# EAGLE design avr328 (EAGLE 9.6.2)
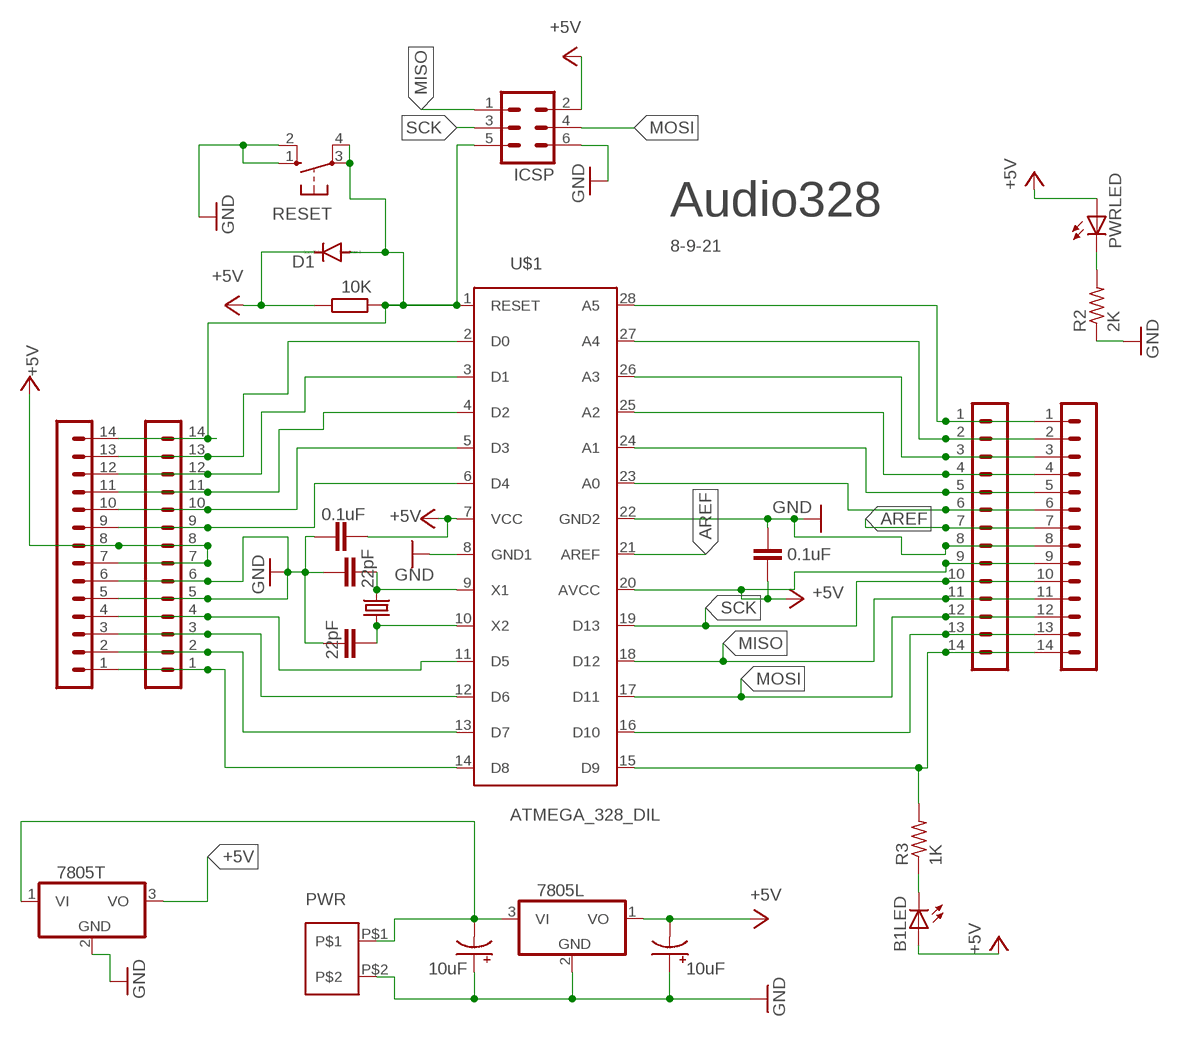
[diagram p0: schematic, sheet 1]

## Parts
-  14_PIN_CONN  [14_PIN_CONN]
.  14_PIN_CONN  [14_PIN_CONN]
.-  14_PIN_CONN  [14_PIN_CONN]
..  14_PIN_CONN  [14_PIN_CONN]
B1LED  LED3MM  [LED3MM]
C1  22pF  C-EU025-024X044  [C025-024X044]
C2  22pF  C-EU025-024X044  [C025-024X044]
C3  0.1uF  C-EU025-024X044  [C025-024X044]
C5  0.1uF  C-EU025-024X044  [C025-024X044]
C7  10uF  CPOL-USE2-5  [E2-5]
C8  10uF  CPOL-USE2-5  [E2-5]
D1  1N4148DO35-7  [DO35-7]
IC1  7805L  [TO92]
IC2  7805T  [TO220H]
ICSP  MA03-2  [MA03-2]
PWR  PWR  2_PIN_SCREW_CONN  [2_PIN_SCREW_CONN]
PWRLED  LED3MM  [LED3MM]
R1  10K  R-EU_0207/10  [0207/10]
R2  2K  R-US_0204/5  [0204/5]
R3  1K  R-US_0204/5  [0204/5]
RESET  10-XX  [B3F-10XX]
U$1  ATMEGA_328_DIL  [ATMEGA_328_DIL]
Y1  CRYSTALHC49UV  [HC49U-V]

## Nets
+5V [+5V]: -.9 .-.9 ..7 ..8 ...7 ...8 B1LED.A C3.2 C5.2 C7.- D1.C IC1.1(VO) IC2.3(VO) ICSP.2 PWRLED.A R1.1 U$1.7(VCC) U$1.20(AVCC)
AREF: -.7 .-.7 U$1.21(AREF)
GND: -.8 .-.8 ..5 ..6 ...5 ...6 C1.1 C2.1 C3.1 C5.1 C7.+ C8.+ IC1.2(GND) IC2.2(GND) ICSP.6 PWR.P$2 R2.1 RESET.1(S) RESET.2(S1) U$1.8(GND1) U$1.22(GND2)
MISO: -.11 .-.11 ICSP.1 U$1.18(D12)
MOSI: -.12 .-.12 ICSP.4 U$1.17(D11)
N$1: ..14 ...14 D1.A ICSP.5 R1.2 RESET.3(P) RESET.4(P1) U$1.1(RESET)
N$2: C1.2 U$1.9(X1) Y1.2
N$3: C2.2 U$1.10(X2) Y1.1
N$4: ..13 ...13 U$1.2(D0)
N$5: ..12 ...12 U$1.3(D1)
N$6: ..11 ...11 U$1.4(D2)
N$7: C8.- IC1.3(VI) IC2.1(VI) PWR.P$1
N$8: ..9 ...9 U$1.6(D4)
N$9: B1LED.K(C) R3.1
N$10: -.1 .-.1 U$1.28(A5)
N$11: -.2 .-.2 U$1.27(A4)
N$12: -.3 .-.3 U$1.26(A3)
N$13: -.4 .-.4 U$1.25(A2)
N$14: -.5 .-.5 U$1.24(A1)
N$15: -.6 .-.6 U$1.23(A0)
N$16: -.14 .-.14 R3.2 U$1.15(D9)
N$17: -.13 .-.13 U$1.16(D10)
N$19: PWRLED.K(C) R2.2
N$21: ..1 ...1 U$1.14(D8)
N$22: ..2 ...2 U$1.13(D7)
N$23: ..3 ...3 U$1.12(D6)
N$24: ..4 ...4 U$1.11(D5)
N$26: ..10 ...10 U$1.5(D3)
SCK: -.10 .-.10 ICSP.3 U$1.19(D13)

## Notes on the sheet
- Audio328
- 8-9-21

## Library data of the parts
- . .- .. = 14_PIN_CONN:14_PIN_CONN
B1LED PWRLED = adafruit:LED: LED OSRAM: - CHIPLED LG R971, LG N971, LY N971, LG Q971, LY Q971, LO R971, LY R971 LH N974, LH R974 LS Q976, LO Q976, LY Q976 LO Q996 - Hyper CHIPLED LW Q18S LB Q993, LB Q99A, LB R99A - SideLED LS A670, LO A670, LY A670, LG A670, LP A670 LB A673, LV A673, LT A673, LW A673 LH A674 LY A675 LS A676, LA A676, LO A676, LY A676, LW A676 LS A679, LY A679, LG A679 - Hyper Micro SIDELED® LS Y876, LA Y876, LO Y876, LY Y876 LT Y87S - SmartLED LW L88C, LW L88S LB L89C, LB L89S, LG L890 LS L89K, LO L89K, LY L89K LS L896, LA L896, LO L896, LY L896 - TOPLED LS T670, LO T670, LY T670, LG T670, LP T670 LSG T670, LSP T670, LSY T670, LOP T670, LYG T670 LG T671, LOG T671, LSG T671 LB T673, LV T673, LT T673, LW T673 LH T674 LS T676, LA T676, LO T676, LY T676, LB T676, LH T676, LSB T676, LW T676 LB T67C, LV T67C, LT T67C, LS T67K, LO T67K, LY T67K, LW E67C LS E67B, LA E67B, LO E67B, LY E67B, LB E67C, LV E67C, LT E67C LW T67C LS T679, LY T679, LG T679 LS T770, LO T770, LY T770, LG T770, LP T770 LB T773, LV T773, LT T773, LW T773 LH T774 LS E675, LA E675, LY E675, LS T675 LS T776, LA T776, LO T776, LY T776, LB T776 LHGB T686 LT T68C, LB T68C - Hyper Mini TOPLED® LB M676 - Mini TOPLED Santana® LG M470 LS M47K, LO M47K, LY M47K Source: http://www.osram.convergy.de/
C1-C3 C5 = resistor:C-EU: CAPACITOR, European symbol
C7 C8 = rcl:CPOL-US: POLARIZED CAPACITOR, American symbol; SPICEPREFIX: C
D1 = diode:1N4148: DIODE high speed (Philips)
IC1 IC2 = adafruit:78*: Positive VOLTAGE REGULATOR Added bigger pads to the TO-92 package
ICSP = con-lstb:MA03-2: PIN HEADER; OC_FARNELL: unknown; OC_NEWARK: unknown
PWR = 2 Pin screw Conn:2_PIN_SCREW_CONN
R1 = resistor:R-EU_: RESISTOR, European symbol
R2 R3 = adafruit:R-US_: RESISTOR, American symbol
RESET = switch-omron:10-XX: OMRON SWITCH; MPN: B3F-1000; OC_FARNELL: 176432; OC_NEWARK: 36M3542
U$1 = Atmega_328_DIL:ATMEGA_328_DIL
Y1 = SparkFun-FreqCtrl:CRYSTAL: Various standard crystals. Proven footprints. Spark Fun Electronics SKU : COM-00534

## Net classes
1 +5V: width 0.381 mm

## Board
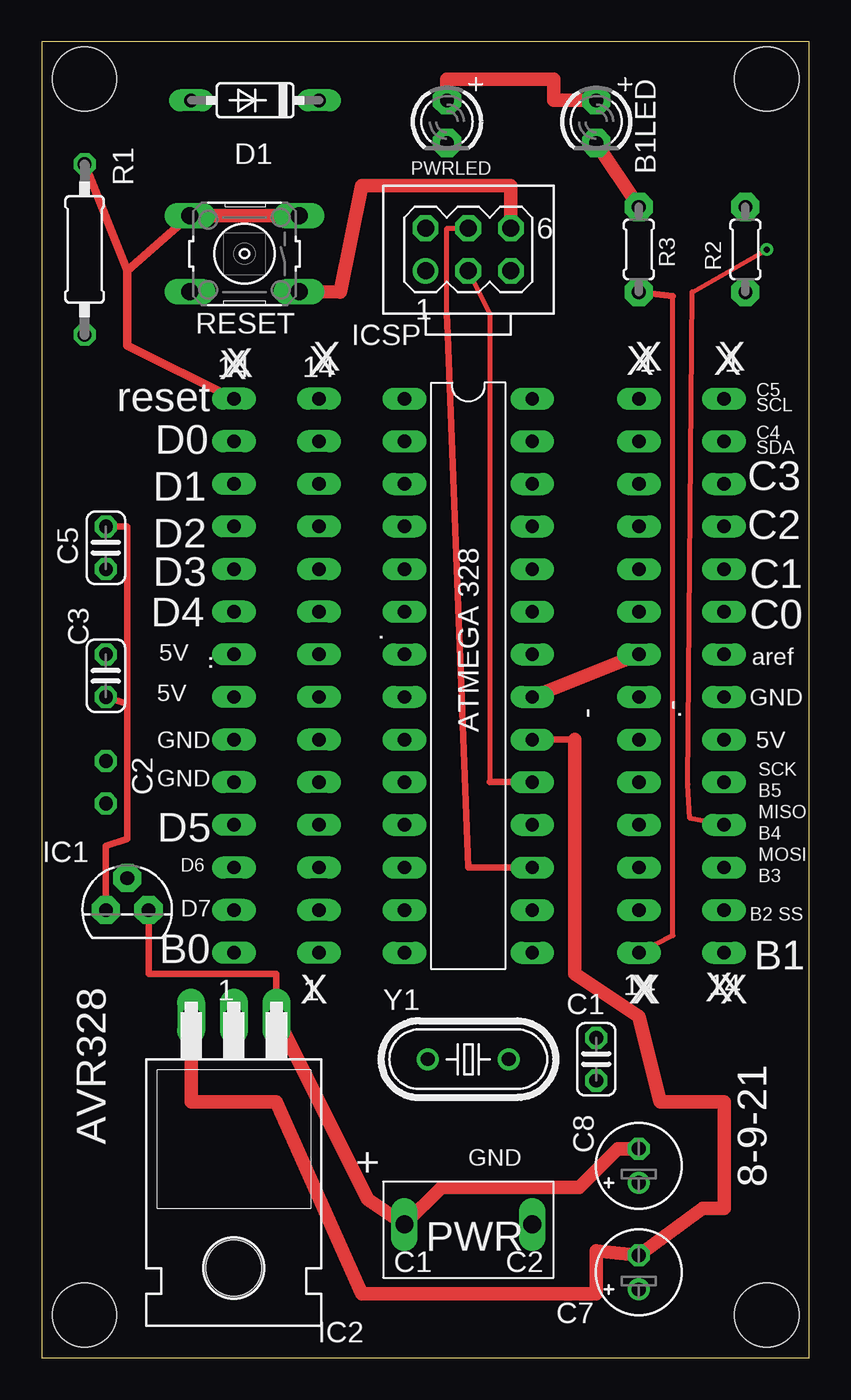
[diagram p1: board, top side]
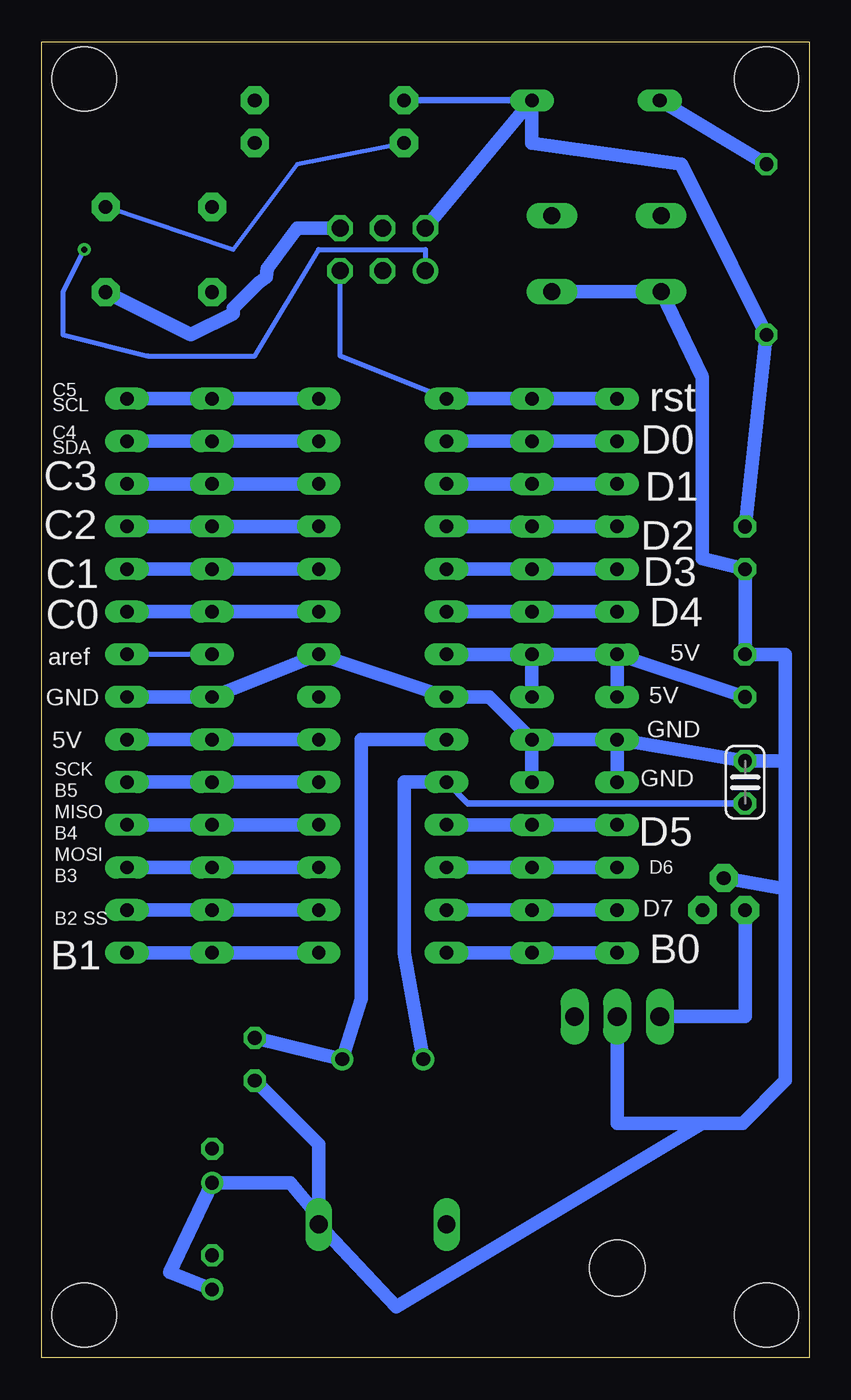
[diagram p2: board, bottom side, seen from below]

Size 45.7 x 78.41 mm. Coordinates in mm from the lower left corner, seen from the top.
Outline: 0,0 45.7,0 45.7,78.41 0,78.41 0,0
Copper layers (1*16): Top 0.035mm / dielectric 1.5mm / Bottom 0.035mm
Design rules "default": minimum track width 6mil, minimum drill 0.35mm, track to track 6mil, track to pad 6mil, pad to pad 6mil, via to via 6mil, smd to smd 6mil, copper to edge 40mil, drill to drill 6mil, minimum pad ring 10mil, minimum via ring 8mil, stop-mask expansion 4mil, vias tented up to drill 0mil, thermal gap 10mil
Holes 3.81 mm at 2.54,76.2 43.18,76.2 43.18,2.54 2.54,2.54

### Footprints (pad centres in the part's own frame; a part is rotated, then mirrored left to right if it is on the bottom)
14_PIN_CONN = drill 0.8 long: 1 -16.51,0; 2 -13.97,0; 3 -11.43,0; 4 -8.89,0; 5 -6.35,0; 6 -3.81,0; 7 -1.27,0; 8 1.27,0; 9 3.81,0; 10 6.35,0; 11 8.89,0; 12 11.43,0; 13 13.97,0; 14 16.51,0
LED3MM = drill 0.813 pad 1.676 octagon: A -1.27,0; K 1.27,0
C025-024X044 = drill 0.813 octagon: 1 -1.27,0; 2 1.27,0
E2-5 = drill 0.813 pad 1.27: + -1.016,0 | drill 0.813 pad 1.27 octagon: - 1.016,0
DO35-7 = drill 0.813 long: A 3.81,0; C -3.81,0
TO92 = drill 0.813 pad 1.676 octagon: 1 -1.27,0; 2 0,1.905; 3 1.27,0
TO220H = drill 1.118 long: 1 -2.54,-10.16; 2 0,-10.16; 3 2.54,-10.16 | hole 3.302: 0,4.826
MA03-2 = drill 1.016: 1 -2.54,-1.27 | drill 1.016 octagon: 2 -2.54,1.27; 3 0,-1.27; 4 0,1.27; 5 2.54,-1.27; 6 2.54,1.27
2_PIN_SCREW_CONN = drill 1.05 long: P$1 -3.81,0.318; P$2 3.81,0.318
0207/10 = drill 0.813 octagon: 1 -5.08,0; 2 5.08,0
0204/5 = drill 0.813 pad 1.676 octagon: 1 -2.54,0; 2 2.54,0
B3F-10XX = drill 1.016 long: 1 -3.251,2.261; 2 3.251,2.261; 3 -3.251,-2.261; 4 3.251,-2.261
ATMEGA_328_DIL = drill 0.8 long: 1 -16.51,-3.81; 2 -13.97,-3.81; 3 -11.43,-3.81; 4 -8.89,-3.81; 5 -6.35,-3.81; 6 -3.81,-3.81; 7 -1.27,-3.81; 8 1.27,-3.81; 9 3.81,-3.81; 10 6.35,-3.81; 11 8.89,-3.81; 12 11.43,-3.81; 13 13.97,-3.81; 14 16.51,-3.81; 15 16.51,3.81; 16 13.97,3.81; 17 11.43,3.81; 18 8.89,3.81; 19 6.35,3.81; 20 3.81,3.81; 21 1.27,3.81; 22 -1.27,3.81; 23 -3.81,3.81; 24 -6.35,3.81; 25 -8.89,3.81; 26 -11.43,3.81; 27 -13.97,3.81; 28 -16.51,3.81
HC49U-V = drill 0.813: 1 -2.413,0; 2 2.413,0

### Placement (x,y rotation side)
-  35.56,40.64 270 top
.  16.51,40.64 90 top
.-  40.64,40.64 270 top
..  11.43,40.64 90 top
B1LED  33.02,73.66 270 top
C1  33.02,17.78 90 top
C2  3.81,34.29 270 bottom
C3  3.81,40.64 270 top
C5  3.81,48.26 90 top
C7  35.56,5.08 90 top
C8  35.56,11.43 90 top
D1  12.7,74.93 180 top
IC1  5.08,26.67 0 top
IC2  11.43,10.16 180 top
ICSP  25.4,66.04 0 top
PWR  25.4,7.62 0 top
PWRLED  24.13,73.66 270 top
R1  2.54,66.04 90 top
R2  41.91,66.04 90 top
R3  35.56,66.04 270 top
RESET  12.06,65.79 180 top
U$1  25.4,40.64 270 top
Y1  25.4,17.78 0 top

### Tracks (layer width: path | path; a pad name or v marks a point on that pad's centre or on a via)
+5V
  Top 0.381: IC1.1 3.81,30.48 5.08,30.9 5.08,38.95 | 5.08,38.95 C3.2 | 5.08,38.95 5.08,49.53 C5.2 | 31.75,36.83 U$1.20
  Top 0.813: IC2.3 8.89,15.24 13.97,15.24 19.05,3.81 33.02,3.81 33.02,6.35 C7.- 39.37,8.89 40.64,8.89 40.64,15.24 36.83,15.24 35.56,20.32 31.75,22.86 31.75,36.83 | PWRLED.A 24.13,76.2 30.48,76.2 30.48,74.93 B1LED.A
  Bottom 0.381: PWRLED.A D1.C
  Bottom 0.813: IC2.3 3.81,20.32 IC1.1 | ...8 ..8 | ..8 U$1.7 | C3.2 ...8 | C5.2 R1.1 4.57,65.02 7.62,71.12 16.51,72.39 D1.C ICSP.2 | ...7 ...8 | U$1.20 -.9 .-.9 | ..7 ..8
AREF
  Top 0.813: U$1.21 -.7
  Bottom 0.305: -.7 .-.7
GND
  Top 0.813: ICSP.6 27.94,69.85 19.05,69.85 17.78,63.5 RESET.1
  Bottom 0.813: PWR.P$2 29.21,8.38 30.9,10.41 C8.+ 38.1,5.08 C7.+ | C1.1 29.21,12.7 PWR.P$2 | PWR.P$2 24.59,3.03 6.35,13.97 | IC2.2 11.43,13.97 6.35,13.97 | 6.35,13.97 3.96,13.97 1.42,16.51 1.42,27.94 | 1.42,27.94 IC1.2 | 1.42,27.94 1.42,35.56 | 1.42,35.56 C2.1 ...6 | 1.42,35.56 1.42,41.91 C3.1 C5.1 6.35,47.62 6.35,58.42 RESET.2 RESET.1 | ...6 ..6 | .-.8 -.8 U$1.22 U$1.8 19.05,39.37 ..6 | ..5 ..6 | ...5 ...6 | R2.1 36.83,60.96 34.29,62.23 34.29,62.55 32.82,64.03 32.35,64.39 32.29,64.9 30.48,67.31 ICSP.6
MISO  (via drill 0.35)
  Top 0.305: .-.11 38.61,32.13 38.48,34.16 38.73,63.5 v43.18,66.04
  Bottom 0.305: v43.18,66.04 44.45,63.5 44.45,60.96 39.37,59.69 33.02,59.69 29.21,66.04 22.86,66.04 ICSP.1
  Bottom 0.813: U$1.18 -.11 .-.11
MOSI
  Top 0.305: 24.13,62.23 24.13,67.31 ICSP.4
  Top 0.381: U$1.17 25.4,29.21 24.18,60.96 24.13,62.23
  Bottom 0.813: U$1.17 -.12 .-.12
N$1
  Top 0.508: ...14 5.08,60.33 5.08,64.77 | 5.08,64.77 RESET.4 | 5.08,64.77 R1.2
  Top 0.813: RESET.4 RESET.3
  Bottom 0.305: U$1.1 27.94,59.69 ICSP.5
  Bottom 0.813: R1.2 D1.A | ...14 ..14 U$1.1
N$2
  Bottom 0.813: C1.2 Y1.2 26.67,21.39 26.67,36.83 U$1.9
N$3
  Bottom 0.381: C2.2 20.32,33.02 U$1.10
  Bottom 0.813: Y1.1 24.13,24.13 24.13,34.29 U$1.10
N$4
  Bottom 0.813: ...13 ..13 U$1.2
N$5
  Bottom 0.813: ...12 ..12 U$1.3
N$6
  Bottom 0.813: ...11 ..11 U$1.4
N$7
  Top 0.381: IC2.1 13.97,22.86 6.35,22.86 IC1.3
  Top 0.813: C8.- 34.29,12.45 32,10.16 23.81,10.16 PWR.P$1 19.41,9.43 IC2.1
N$8
  Bottom 0.813: ...9 ..9 U$1.6
N$9
  Top 0.813: R3.1 B1LED.K
N$10
  Bottom 0.813: U$1.28 -.1 .-.1
N$11
  Bottom 0.813: U$1.27 -.2 .-.2
N$12
  Bottom 0.813: U$1.26 -.3 .-.3
N$13
  Bottom 0.813: U$1.25 -.4 .-.4
N$14
  Bottom 0.813: U$1.24 -.5 .-.5
N$15
  Bottom 0.813: U$1.23 -.6 .-.6
N$16
  Top 0.305: -.14 37.59,25.15 37.59,63.27
  Top 0.381: 37.59,63.27 R3.2
  Bottom 0.813: U$1.15 -.14 .-.14
N$17
  Bottom 0.813: U$1.16 -.13 .-.13
N$19
  Bottom 0.254: R2.2 34.29,66.04 30.48,71.12 PWRLED.K
N$21
  Bottom 0.813: ...1 ..1 U$1.14
N$22
  Bottom 0.813: ...2 ..2 U$1.13
N$23
  Bottom 0.813: ...3 ..3 U$1.12
N$24
  Bottom 0.813: ...4 ..4 U$1.11
N$26
  Bottom 0.813: ...10 ..10 U$1.5
SCK
  Top 0.305: 26.67,34.29 26.67,62.23 ICSP.3
  Top 0.381: U$1.19 26.67,34.29
  Bottom 0.813: U$1.19 -.10 .-.10

### Text on the board
tNames: X | X | X | X | X | X | X | X | C5 | reset | SCL | C4 | D0 | SDA | C3 | D1 | C2 | D2 | D3 | C1 | D4 | C0 | 5V | aref | 5V | GND | GND | 5V | SCK | GND | B5 | MISO | D5 | B4 | MOSI | D6 | B3 | D7 | B2 SS | B0 | B1 | X | X | X | X | X | AVR328 | + | GND | 8-9-21 | PWR
bNames: C5 | rst | SCL | C4 | D0 | SDA | C3 | D1 | C2 | D2 | D3 | C1 | D4 | C0 | 5V | aref | 5V | GND | GND | 5V | SCK | GND | B5 | MISO | B4 | D5 | MOSI | D6 | B3 | D7 | B2 SS | B0 | B1